# EAGLE design S4M13 (EAGLE 7.7.0)
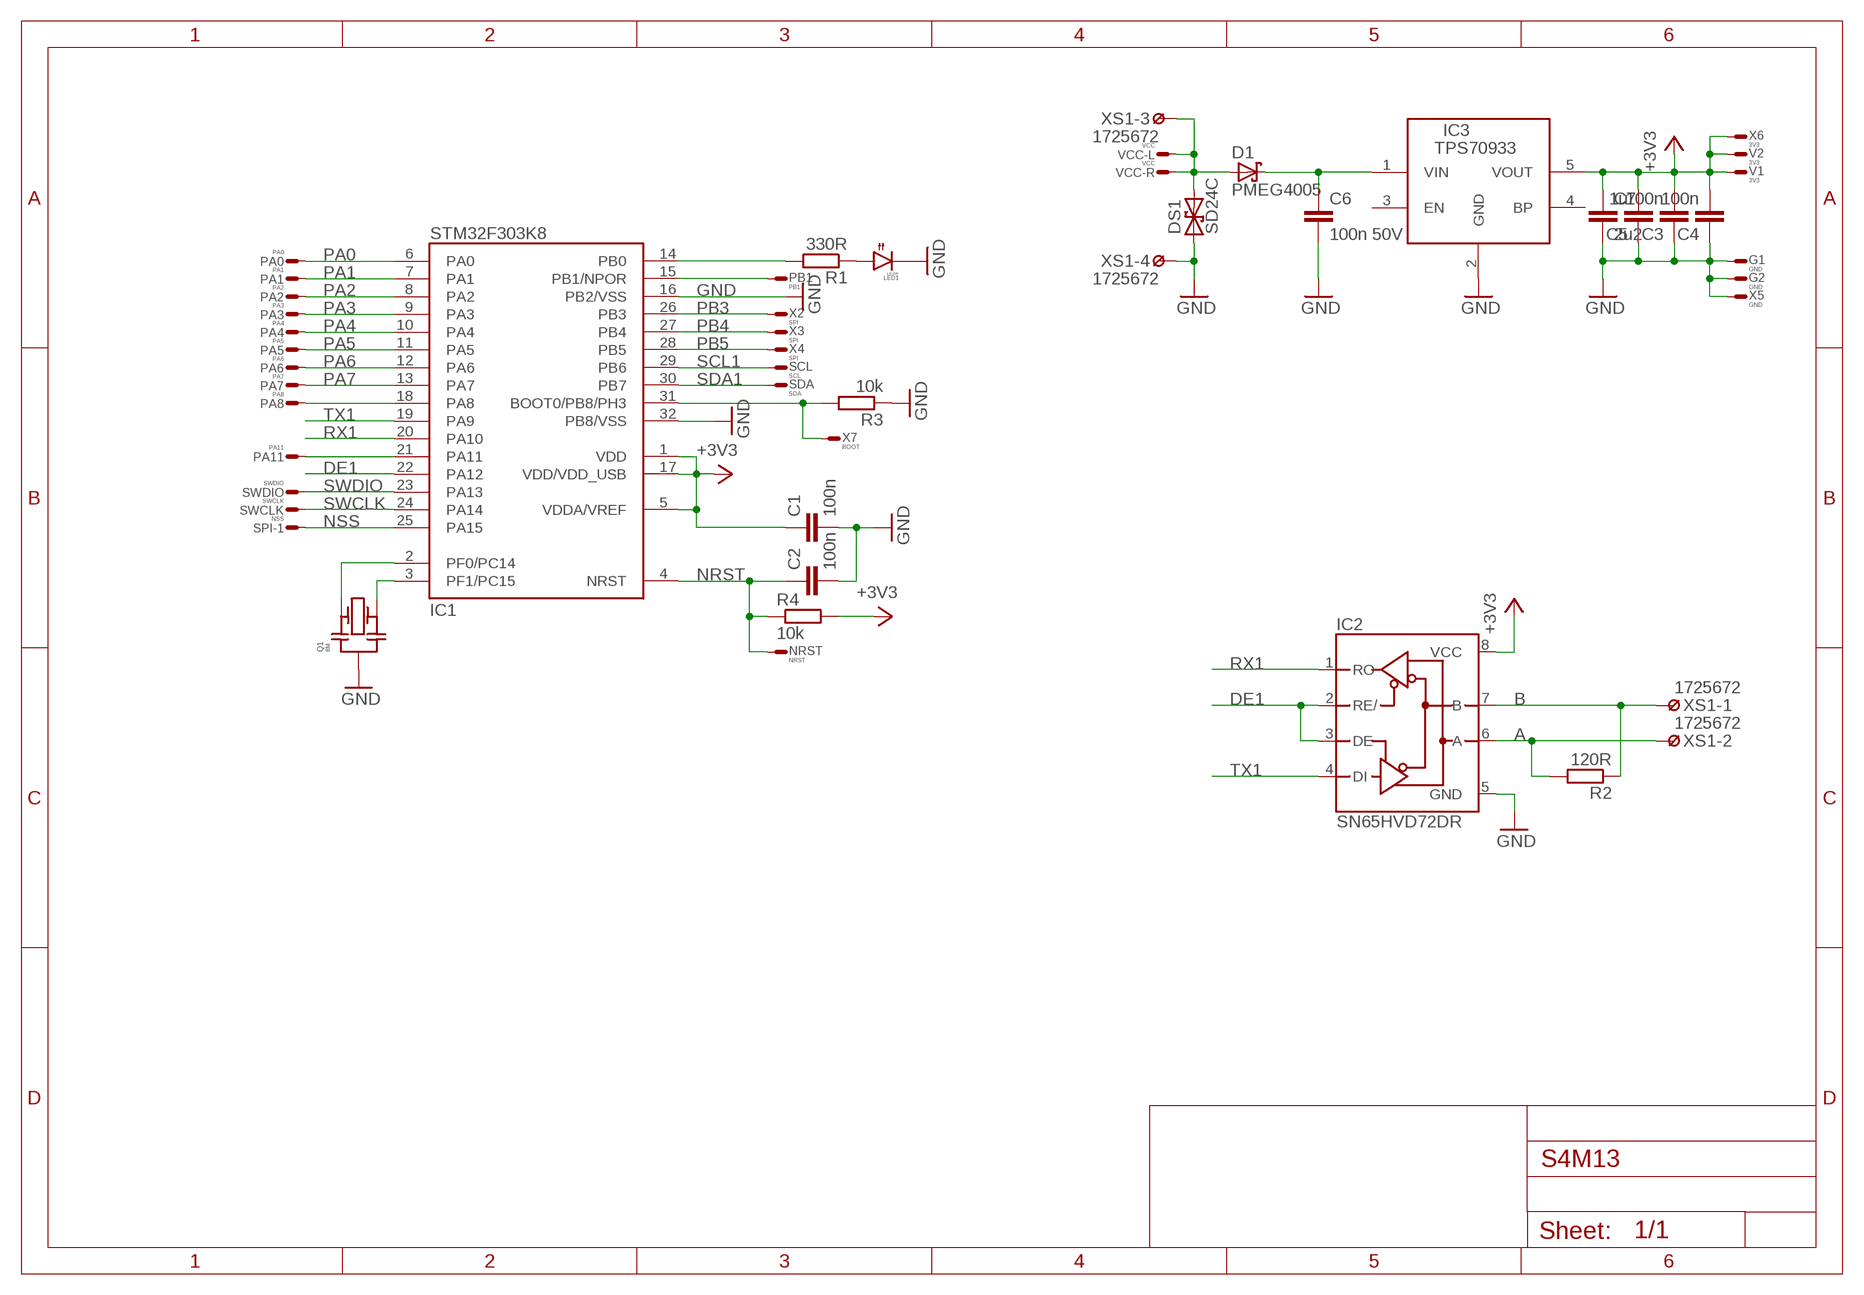
[diagram p0: schematic, sheet 1]

## Parts
C1  100n  C0603  [0603]
C2  100n  C0603  [0603]
C3  100n  C0603  [0603]
C4  100n  C0603  [0603]
C5  1u  C0603  [0603]
C6  100n 50V  C0603  [0603]
C7  2u2  C0603  [0603]
D1  PMEG4005  D-SCHOTKY323  [SOD323]
DS1  SD24C  TVS-U323  [SOD323]
G1  GND  WIREPADT1.6/0.9  [T1.6/0.9]
G2  GND  WIREPADT1.6/0.9  [T1.6/0.9]
IC1  STM32F303K8  STM32_LQFP32  [LQFP32-7X7]
IC2  SN65HVD72DR  MAX485  [SOIC8]
IC3  TPS70933  LDO  [SOT23-5]
LED1  LEDR  LED1206  [1206]
NRST  NRST  WIREPADT1.6/0.9  [T1.6/0.9]
PA0  PA0  WIREPADT1.6/0.9  [T1.6/0.9]
PA1  PA1  WIREPADT1.6/0.9  [T1.6/0.9]
PA2  PA2  WIREPADT1.6/0.9  [T1.6/0.9]
PA3  PA3  WIREPADT1.6/0.9  [T1.6/0.9]
PA4  PA4  WIREPADT1.6/0.9  [T1.6/0.9]
PA5  PA5  WIREPADT1.6/0.9  [T1.6/0.9]
PA6  PA6  WIREPADT1.6/0.9  [T1.6/0.9]
PA7  PA7  WIREPADT1.6/0.9  [T1.6/0.9]
PA8  PA8  WIREPADT1.6/0.9  [T1.6/0.9]
PA11  PA11  WIREPADT1.6/0.9  [T1.6/0.9]
PB1  PB1  WIREPADT1.6/0.9  [T1.6/0.9]
Q1  8M  QRCE  [CSTCE]
R1  330R  R0603  [0603]
R2  120R  R0603  [0603]
R3  10k  R0603  [0603]
R4  10k  R0603  [0603]
SCL  SCL  WIREPADT1.6/0.9  [T1.6/0.9]
SDA  SDA  WIREPADT1.6/0.9  [T1.6/0.9]
SPI-1  NSS  WIREPADS1.6/0.8  [S1.6/0.8]
SWCLK  SWCLK  WIREPADT1.6/0.9  [T1.6/0.9]
SWDIO  SWDIO  WIREPADT1.6/0.9  [T1.6/0.9]
V1  3V3  WIREPADT1.6/0.9  [T1.6/0.9]
V2  3V3  WIREPADT1.6/0.9  [T1.6/0.9]
VCC-L  VCC  WIREPADT1.6/0.9  [T1.6/0.9]
VCC-R  VCC  WIREPADT1.6/0.9  [T1.6/0.9]
X2  SPI  WIREPADS1.6/0.8  [S1.6/0.8]
X3  SPI  WIREPADS1.6/0.8  [S1.6/0.8]
X4  SPI  WIREPADS1.6/0.8  [S1.6/0.8]
X5  GND  WIREPADS1.6/0.8  [S1.6/0.8]
X6  3V3  WIREPADS1.6/0.8  [S1.6/0.8]
X7  BOOT  WIREPADR  [S1.27R]
XS1  1725672  [1725672]

## Nets
+3V3: C1.1 C3.2 C4.2 C5.2 C7.1 IC1.1(VDD) IC1.5(VDDA/VREF) IC1.17(VDD/VDD_USB) IC2.8(VCC) IC3.5(VOUT) R4.2 V1.1(S) V2.1(S) X6.W(S)
A: IC2.6(A) R2.2 XS1.2
B: IC2.7(B) R2.1 XS1.1
DE1: IC1.22(PA12) IC2.2(RE/) IC2.3(DE)
GND: C1.2 C2.2 C3.1 C4.1 C5.1 C6.2 C7.2 DS1.A G1.1(S) G2.1(S) IC1.16(PB2/VSS) IC1.32(PB8/VSS) IC2.5(GND) IC3.2(GND) LED1.2(C) Q1.G(M) R3.1 X5.W(S) XS1.4
LED: IC1.14(PB0) R1.2
N$2: IC1.3(PF1/PC15) Q1.B
N$3: IC1.31(BOOT0/PB8/PH3) R3.2 X7.1(S)
N$5: IC1.2(PF0/PC14) Q1.A
N$10: C6.1 D1.C IC3.1(VIN)
N$11: LED1.1(A) R1.1
NRST: C2.1 IC1.4(NRST) NRST.1(S) R4.1
NSS: IC1.25(PA15) SPI-1.W(S)
PA0: IC1.6(PA0) PA0.1(S)
PA1: IC1.7(PA1) PA1.1(S)
PA2: IC1.8(PA2) PA2.1(S)
PA3: IC1.9(PA3) PA3.1(S)
PA4: IC1.10(PA4) PA4.1(S)
PA5: IC1.11(PA5) PA5.1(S)
PA6: IC1.12(PA6) PA6.1(S)
PA7: IC1.13(PA7) PA7.1(S)
PA8: IC1.18(PA8) PA8.1(S)
PA11: IC1.21(PA11) PA11.1(S)
PB1: IC1.15(PB1/NPOR) PB1.1(S)
PB3: IC1.26(PB3) X2.W(S)
PB4: IC1.27(PB4) X3.W(S)
PB5: IC1.28(PB5) X4.W(S)
RX1: IC1.20(PA10) IC2.1(RO)
SCL1: IC1.29(PB6) SCL.1(S)
SDA1: IC1.30(PB7) SDA.1(S)
SWCLK: IC1.24(PA14) SWCLK.1(S)
SWDIO: IC1.23(PA13) SWDIO.1(S)
TX1: IC1.19(PA9) IC2.4(DI)
VIN: D1.A DS1.C VCC-L.1(S) VCC-R.1(S) XS1.3
Unconnected: IC3.3(EN) IC3.4(BP)

## Library data of the parts
C1-C7 = RCL:C: Capacitor SMD
D1 = Diode:D-SCHOTKY: Schottky Diode
DS1 = Diode:TVS-U: DIODE
G1 G2 NRST PA0 PA1-PA8 PA11 PB1 SCL SDA SPI-1 SWCLK SWDIO V1 V2 VCC-L VCC-R X2-X7 = Conn:WIREPAD: Wire PAD connect wire on PCB
IC1 = STM32:STM32_LQFP32
IC2 = ICs:MAX485
IC3 = DCDC:LDO
LED1 = Optic:LED
Q1 = QUARTZ:QR
R1-R4 = RCL:R: Resistor SMD
XS1 = Conn:1725672

## Board
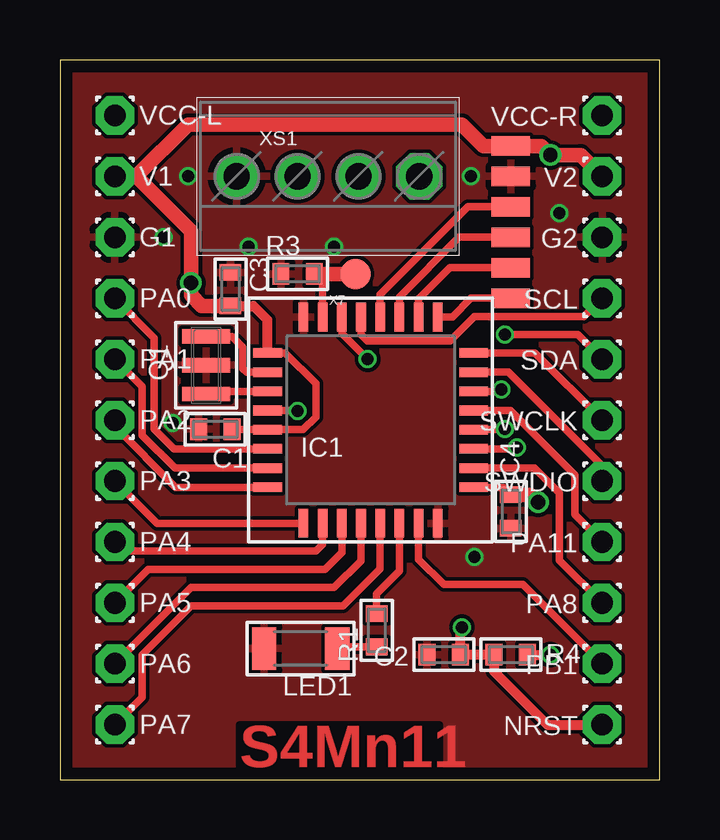
[diagram p1: board, top side]
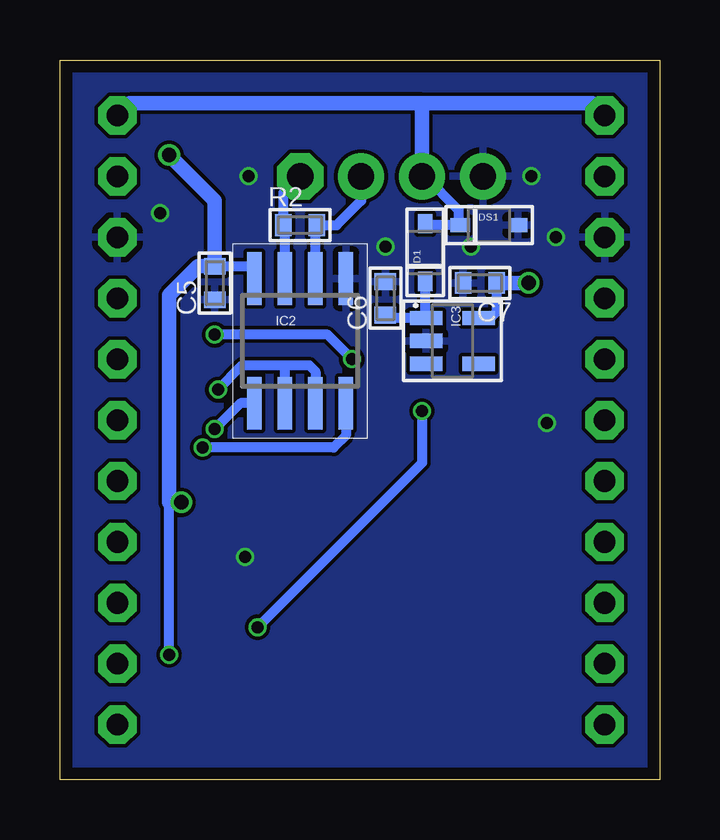
[diagram p2: board, bottom side, seen from below]

Size 25 x 30 mm. Coordinates in mm from the lower left corner, seen from the top.
Outline: 0,0 25,0 25,30 0,30 0,0
Copper layers (1*16): Top 0.035mm / dielectric 1.5mm / Bottom 0.035mm
Design rules "default *": minimum track width 6mil, minimum drill 12mil, track to track 6mil, track to pad 6mil, pad to pad 6mil, via to via 6mil, smd to smd 6mil, copper to edge 20mil, drill to drill 8mil, minimum pad ring 0mil, minimum via ring 0mil, stop-mask expansion 2mil, vias tented up to drill 24mil, thermal gap 10mil

### Footprints (pad centres in the part's own frame; a part is rotated, then mirrored left to right if it is on the bottom)
0603 = smd 0.7 x 0.9: 1 -0.697,0; 2 0.697,0
SOD323 = smd 0.8 x 0.6: A 1.2,0; C -1.2,0
T1.6/0.9 = drill 0.9 pad 1.6 octagon: 1 0,0
LQFP32-7X7 = smd 1.2 x 0.4: 1 -4.3,2.8; 2 -4.3,2; 3 -4.3,1.2; 4 -4.3,0.4; 5 -4.3,-0.4; 6 -4.3,-1.2; 7 -4.3,-2; 8 -4.3,-2.8; 17 4.3,-2.8; 18 4.3,-2; 19 4.3,-1.2; 20 4.3,-0.4; 21 4.3,0.4; 22 4.3,1.2; 23 4.3,2; 24 4.3,2.8 | smd 0.4 x 1.2: 9 -2.8,-4.3; 10 -2,-4.3; 11 -1.2,-4.3; 12 -0.4,-4.3; 13 0.4,-4.3; 14 1.2,-4.3; 15 2,-4.3; 16 2.8,-4.3; 25 2.8,4.3; 26 2,4.3; 27 1.2,4.3; 28 0.4,4.3; 29 -0.4,4.3; 30 -1.2,4.3; 31 -2,4.3; 32 -2.8,4.3
SOIC8 = smd 0.6 x 2.2: 1 -1.905,-2.6; 2 -0.635,-2.6; 3 0.635,-2.6; 4 1.905,-2.6; 5 1.905,2.6; 6 0.635,2.6; 7 -0.635,2.6; 8 -1.905,2.6
SOT23-5 = smd 0.6 x 1.35: 1 -0.95,-1.101; 2 0,-1.101; 3 0.95,-1.101; 4 0.95,1.101; 5 -0.951,1.101
1206 = smd 1.016 x 1.778: 1 -1.524,0; 2 1.524,0
CSTCE = smd 0.6 x 2: A -1.2,0; B 1.2,0; G 0,0
S1.6/0.8 = smd 0.8 x 1.6: W 0,0
S1.27R = smd 1.27 x 1.27: 1 0,0
1725672 = drill 1.1 pad 1.93 octagon: 1 -3.81,0 | drill 1.1 pad 1.93: 2 -1.27,0; 3 1.27,0; 4 3.81,0

### Placement (x,y rotation side)
C1  6.48,14.61 180 top
C2  16,5.21 180 top
C3  7.11,20.45 270 top
C4  18.8,11.18 90 top
C5  18.54,20.7 90 bottom
C6  11.43,20.07 90 bottom
C7  7.49,20.7 180 bottom
D1  9.78,21.97 90 bottom
DS1  7.11,23.11 0 bottom
G1  2.29,22.61 0 top
G2  22.61,22.61 180 top
IC1  12.95,14.99 0 top
IC2  14.99,18.29 0 bottom
IC3  8.64,18.29 270 bottom
LED1  10.03,5.46 180 top
NRST  22.61,2.29 180 top
PA0  2.29,20.07 0 top
PA1  2.29,17.53 0 top
PA2  2.29,14.99 0 top
PA3  2.29,12.45 0 top
PA4  2.29,9.91 0 top
PA5  2.29,7.37 0 top
PA6  2.29,4.83 0 top
PA7  2.29,2.29 0 top
PA8  22.61,7.37 180 top
PA11  22.61,9.91 180 top
PB1  22.61,4.83 180 top
Q1  6.1,17.27 270 top
R1  13.21,6.22 90 top
R2  14.99,23.11 0 bottom
R3  9.91,21.08 0 top
R4  18.8,5.21 0 top
SCL  22.61,20.07 180 top
SDA  22.61,17.53 180 top
SPI-1  18.8,20.07 270 top
SWCLK  22.61,14.99 180 top
SWDIO  22.61,12.45 180 top
V1  2.29,25.15 0 top
V2  22.61,25.15 180 top
VCC-L  2.29,27.69 0 top
VCC-R  22.61,27.69 180 top
X2  18.8,21.34 270 top
X3  18.8,22.61 270 top
X4  18.8,23.88 270 top
X5  18.8,25.15 90 top
X6  18.8,26.42 90 top
X7  12.32,21.08 0 top
XS1  11.18,25.15 180 top

### Tracks (layer width: path | path; a pad name or v marks a point on that pad's centre or on a via)
+3V3  (via drill 0.5, 0.6)
  Top 0.305: C1.1 7.19,14.59 IC1.5 10.14,14.59 10.67,15.11 10.67,16.51 9.39,17.79 IC1.1 | IC1.17 18.48,12.19 C4.2
  Top 0.406: IC1.1 8.65,19.16 8.06,19.75 C3.2 | R4.2 v20.45,5.21
  Top 0.61: V2.1 21.72,26.04 v20.45,26.04 20.07,26.42 X6.W 17.65,26.42 16.76,27.3 5.33,27.3 3.17,25.15 | 3.17,25.15 5.46,22.86 v5.46,20.7 5.46,20.19 5.9,19.75 C3.2 | C4.2 19.62,11.87 v19.94,11.56 | 3.17,25.15 V1.1
  Bottom 0.406: C5.2 16.89,21.4 IC2.8 | C7.1 6.8,19.49 6.99,19.3 7.47,19.3 IC3.5 | v20.45,5.21 20.45,11.56
  Bottom 0.61: v19.94,11.56 20.45,11.56 20.45,20.19 19.24,21.4 C5.2 18.54,24.13 v20.45,26.04 | v5.46,20.7 C7.1
A
  Bottom 0.406: IC2.6 14.35,23.05 R2.2 13.46,23.11 12.45,24.13 XS1.2
B
  Bottom 0.406: IC2.7 15.62,23.05 R2.1 15.68,24.45 XS1.1
DE1  (via drill 0.5)
  Top 0.305: IC1.22 18.34,16.19 v18.41,16.26
  Bottom 0.406: v18.41,16.26 17.4,17.27 15.62,17.27 | 15.62,17.27 14.61,17.27 14.35,17.02 IC2.3 | IC2.2 15.62,17.27
GND  (via drill 0.5)
  other vias: 7.87,22.23 4.7,14.86 11.43,22.23 17.27,9.27 5.33,25.15 4.32,22.61 17.14,25.15 20.83,23.62
  pour Bottom: 0,0 25,0 25,30 0,30
  pour Top: 0,0 25,0 25,30 0,30
LED
  Top 0.305: IC1.14 14.15,8.69 13.21,7.75 R1.2
N$2
  Top 0.305: IC1.3 6.21,16.19 Q1.B
N$3
  Top 0.305: IC1.31 10.95,20.73 R3.2
  Top 0.61: R3.2 X7.1
N$5
  Top 0.305: Q1.A 7.18,18.47 7.62,18.03 7.62,17.14 7.78,16.99 IC1.2
N$10
  Bottom 0.406: C6.1 11.3,19.24 IC3.1 9.78,19.28 D1.C
N$11
  Top 0.305: R1.1 11.62,5.53 LED1.1
NRST  (via drill 0.5)
  Top 0.305: IC1.4 9.89,15.39 v9.91,15.37
  Top 0.406: v16.76,6.35 16.7,6.29 C2.1 R4.1 18.1,4.51 20.32,2.29 NRST.1
  Bottom 0.406: v9.91,15.37 9.91,13.21 v16.76,6.35
NSS
  Top 0.305: IC1.25 16.36,19.29 17.14,20.07 SPI-1.W
PA0
  Top 0.305: IC1.6 4.76,13.79 3.94,14.61 3.94,18.41 PA0.1
PA1
  Top 0.305: IC1.7 4.79,12.99 3.43,14.35 3.43,16.38 PA1.1
PA2
  Top 0.305: IC1.8 4.83,12.19 2.29,14.73 PA2.1
PA3
  Top 0.305: IC1.9 4.05,10.69 PA3.1
PA4
  Top 0.305: IC1.10 10.95,9.81 10.67,9.53 2.67,9.53 PA4.1
PA5
  Top 0.305: IC1.11 11.75,9.47 11.05,8.76 3.68,8.76 PA5.1
PA6
  Top 0.305: IC1.12 12.55,9.12 11.43,8 5.46,8 PA6.1
PA7
  Top 0.305: IC1.13 13.35,8.78 11.81,7.24 5.46,7.24 3.43,5.21 3.43,3.43 PA7.1
PA8
  Top 0.305: PA8.1 20.83,9.14 20.83,11.94 19.78,12.99 IC1.18
PA11
  Top 0.305: IC1.21 18.78,15.39 21.46,12.7 21.46,11.05 PA11.1
PB1
  Top 0.305: IC1.15 14.95,9.18 16,8.13 19.3,8.13 PB1.1
PB3
  Top 0.305: X2.W 16.26,21.34 14.95,20.03 IC1.26
PB4
  Top 0.305: X3.W 16.64,22.61 14.15,20.12 IC1.27
PB5
  Top 0.305: 18.92,23.75 X4.W 17.02,23.88 13.35,20.21 IC1.28
RX1  (via drill 0.5)
  Top 0.305: 17.27,14.61 IC1.20 18.52,14.59 v18.54,14.61
  Bottom 0.406: IC2.1 17.46,15.69 v18.54,14.61
SCL1
  Top 0.305: IC1.29 12.55,18.56 12.83,18.29 16.26,18.29 17.27,19.3 21.84,19.3 SCL.1
SDA1  (via drill 0.5)
  Top 0.305: IC1.30 11.75,18.6 v12.83,17.53 | v18.54,18.54 21.59,18.54 SDA.1
  Bottom 0.406: v12.83,17.53 13.84,18.54 v18.54,18.54
SWCLK
  Top 0.305: IC1.24 19.81,17.79 SWCLK.1
SWDIO
  Top 0.305: IC1.23 18.7,16.99 22.61,13.08 SWDIO.1
TX1  (via drill 0.5)
  Top 0.305: IC1.19 18.99,13.79 v19.05,13.84
  Bottom 0.406: IC2.4 13.08,14.35 13.59,13.84 v19.05,13.84
VIN
  Bottom 0.406: D1.A 9.72,23.11 DS1.C 8.38,23.18 8.38,23.75 9.78,25.15 XS1.3
  Bottom 0.61: XS1.3 9.91,28.19 | 9.91,28.19 2.79,28.19 VCC-L.1 | 9.91,28.19 22.1,28.19 VCC-R.1

### Text on the board
Top: S4Mn11